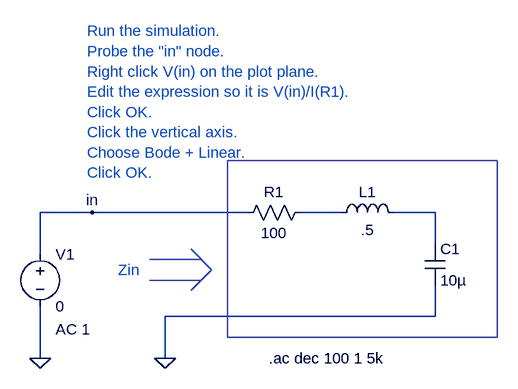
[diagram p0: schematic Zin.asc]
Zin.asc, the LTspice schematic file:
Version 4
SHEET 1 880 680
WIRE 16 224 -64 224
WIRE 256 224 16 224
WIRE 400 224 336 224
WIRE 544 224 480 224
WIRE 544 272 544 224
WIRE -64 288 -64 224
WIRE 544 384 544 336
WIRE 544 384 128 384
WIRE -64 448 -64 368
WIRE 128 448 128 384
FLAG 128 448 0
FLAG -64 448 0
FLAG 16 224 in
SYMBOL res 240 240 R270
WINDOW 0 32 56 VTop 2
WINDOW 3 0 56 VBottom 2
SYMATTR InstName R1
SYMATTR Value 100
SYMBOL ind 384 240 R270
WINDOW 0 32 56 VTop 2
WINDOW 3 5 56 VBottom 2
WINDOW 39 -23 56 VBottom 2
SYMATTR InstName L1
SYMATTR Value .5
SYMBOL cap 528 272 R0
SYMATTR InstName C1
SYMATTR Value 10µ
SYMBOL voltage -64 272 R0
WINDOW 123 24 132 Left 2
WINDOW 39 0 0 Left 2
SYMATTR Value2 AC 1
SYMATTR InstName V1
SYMATTR Value 0
TEXT 288 448 Left 2 !.ac dec 100 1 5k
TEXT 8 -56 Left 2 ;Run the simulation.\nProbe the "in" node.\nRight click V(in) on the plot plane.\nEdit the expression so it is V(in)/I(R1).\nClick OK.\nClick the vertical axis.\nChoose Bode + Linear.\nClick OK.
TEXT 56 312 Left 2 ;Zin
LINE Normal 184 296 104 296
LINE Normal 184 328 104 328
LINE Normal 168 280 200 312
LINE Normal 168 344 200 312
RECTANGLE Normal 640 416 224 144

The netlist it stands for:
* Zin.asc
R1 in N001 100
L1 N001 N002 .5
C1 N002 0 10µ
V1 in 0 0 AC 1
.ac dec 100 1 5k
* Run the simulation.
* Probe the "in" node.
* Right click V(in) on the plot plane.
* Edit the expression so it is V(in)/I(R1).
* Click OK.
* Click the vertical axis.
* Choose Bode + Linear.
* Click OK.
* Zin
.backanno
.end